# Altium schematic sheet main_7.SchDoc: main
size 282 x 200 mm; Date: 9/25/2019 7:26:20 PM; SheetNumber: 8; CNAME: RJ Cunningham; GateName_1: G$1; SymbolName_1: A4L-LOC; LibraryName: frames; DeviceSetName: A4L-LOC
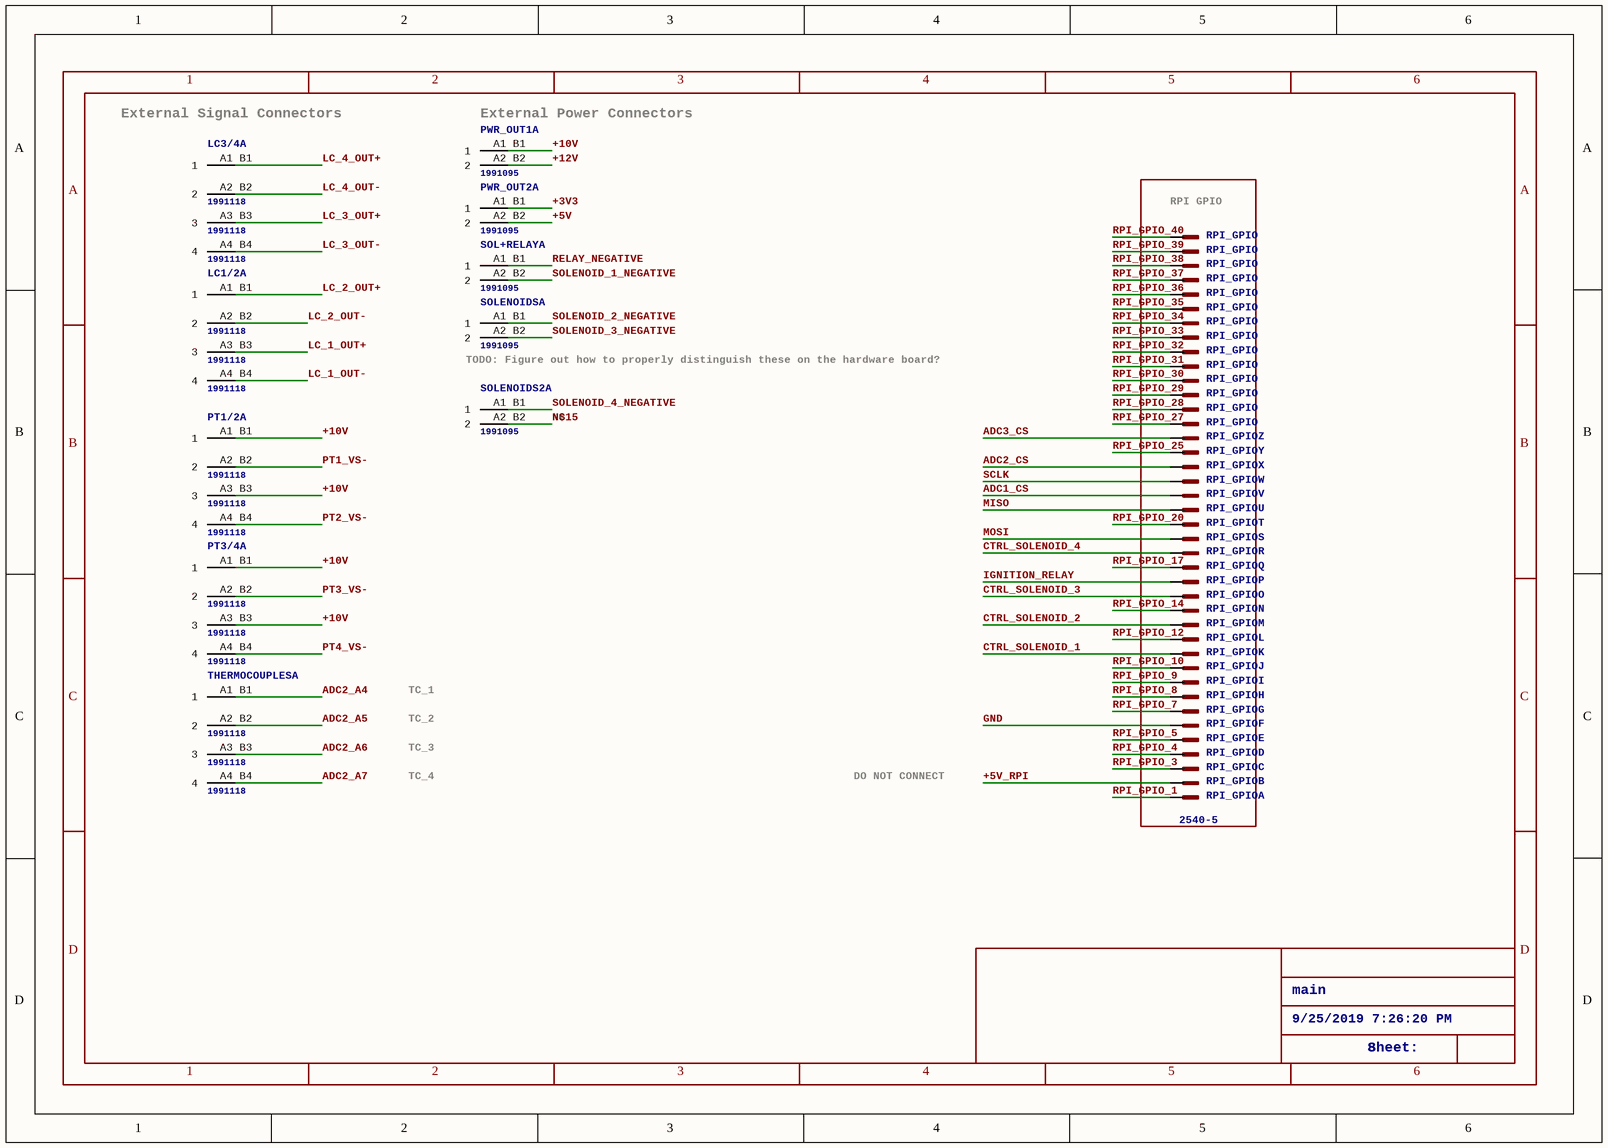
[diagram p0: main_7.SchDoc]

## Parts
LC1/2  1991118  [1991118]  (value not drawn)  (parts A,B,C,D of 4)
LC3/4  1991118  [1991118]  (value not drawn)  (parts A,B,C,D of 4)
PT1/2  1991118  [1991118]  (value not drawn)  (parts A,B,C,D of 4)
PT3/4  1991118  [1991118]  (value not drawn)  (parts A,B,C,D of 4)
PWR_OUT1  1991095  [1991095]  (value not drawn)  (parts A,B of 2)
PWR_OUT2  1991095  [1991095]  (value not drawn)  (parts A,B of 2)
RPI_GPIO  2540-5  [PAK100/2500-5-40]  (parts A,B,C,D,E,F,G,H,I,J,K,L,M,N,O,P,Q,R,S,T,U,V,W,X,Y,Z,27,28,29,30,31,32,33,34,35,36,37,38,39,40 of 40)
SOL+RELAY  1991095  [1991095]  (value not drawn)  (parts A,B of 2)
SOLENOIDS  1991095  [1991095]  (value not drawn)  (parts A,B of 2)
SOLENOIDS2  1991095  [1991095]  (value not drawn)  (parts A,B of 2)
THERMOCOUPLES  1991118  [1991118]  (value not drawn)  (parts A,B,C,D of 4)

## Blocks framed on the sheet
RPI GPIO: RPI_GPIO

## Nets
+3V3: PWR_OUT2.A1_B1(1)
+5V: PWR_OUT2.A2_B2(2)
+5V_RPI: RPI_GPIO.2(KL)
+10V: PT1/2.A1_B1(1) PT1/2.A3_B3(3) PT3/4.A1_B1(1) PT3/4.A3_B3(3) PWR_OUT1.A1_B1(1)
+12V: PWR_OUT1.A2_B2(2)
ADC1_CS: RPI_GPIO.22(KL)
ADC2_A4: THERMOCOUPLES.A1_B1(1)
ADC2_A5: THERMOCOUPLES.A2_B2(2)
ADC2_A6: THERMOCOUPLES.A3_B3(3)
ADC2_A7: THERMOCOUPLES.A4_B4(4)
ADC2_CS: RPI_GPIO.24(KL)
ADC3_CS: RPI_GPIO.26(KL)
CTRL_SOLENOID_1: RPI_GPIO.11(KL)
CTRL_SOLENOID_2: RPI_GPIO.13(KL)
CTRL_SOLENOID_3: RPI_GPIO.15(KL)
CTRL_SOLENOID_4: RPI_GPIO.18(KL)
GND: RPI_GPIO.6(KL)
IGNITION_RELAY: RPI_GPIO.16(KL)
LC_1_OUT+: LC1/2.A3_B3(3)
LC_1_OUT-: LC1/2.A4_B4(4)
LC_2_OUT+: LC1/2.A1_B1(1)
LC_2_OUT-: LC1/2.A2_B2(2)
LC_3_OUT+: LC3/4.A3_B3(3)
LC_3_OUT-: LC3/4.A4_B4(4)
LC_4_OUT+: LC3/4.A1_B1(1)
LC_4_OUT-: LC3/4.A2_B2(2)
MISO: RPI_GPIO.21(KL)
MOSI: RPI_GPIO.19(KL)
N$15: SOLENOIDS2.A2_B2(2)
PT1_VS-: PT1/2.A2_B2(2)
PT2_VS-: PT1/2.A4_B4(4)
PT3_VS-: PT3/4.A2_B2(2)
PT4_VS-: PT3/4.A4_B4(4)
RELAY_NEGATIVE: SOL+RELAY.A1_B1(1)
RPI_GPIO_1: RPI_GPIO.1(KL)
RPI_GPIO_3: RPI_GPIO.3(KL)
RPI_GPIO_4: RPI_GPIO.4(KL)
RPI_GPIO_5: RPI_GPIO.5(KL)
RPI_GPIO_7: RPI_GPIO.7(KL)
RPI_GPIO_8: RPI_GPIO.8(KL)
RPI_GPIO_9: RPI_GPIO.9(KL)
RPI_GPIO_10: RPI_GPIO.10(KL)
RPI_GPIO_12: RPI_GPIO.12(KL)
RPI_GPIO_14: RPI_GPIO.14(KL)
RPI_GPIO_17: RPI_GPIO.17(KL)
RPI_GPIO_20: RPI_GPIO.20(KL)
RPI_GPIO_25: RPI_GPIO.25(KL)
RPI_GPIO_27: RPI_GPIO.27(KL)
RPI_GPIO_28: RPI_GPIO.28(KL)
RPI_GPIO_29: RPI_GPIO.29(KL)
RPI_GPIO_30: RPI_GPIO.30(KL)
RPI_GPIO_31: RPI_GPIO.31(KL)
RPI_GPIO_32: RPI_GPIO.32(KL)
RPI_GPIO_33: RPI_GPIO.33(KL)
RPI_GPIO_34: RPI_GPIO.34(KL)
RPI_GPIO_35: RPI_GPIO.35(KL)
RPI_GPIO_36: RPI_GPIO.36(KL)
RPI_GPIO_37: RPI_GPIO.37(KL)
RPI_GPIO_38: RPI_GPIO.38(KL)
RPI_GPIO_39: RPI_GPIO.39(KL)
RPI_GPIO_40: RPI_GPIO.40(KL)
SCLK: RPI_GPIO.23(KL)
SOLENOID_1_NEGATIVE: SOL+RELAY.A2_B2(2)
SOLENOID_2_NEGATIVE: SOLENOIDS.A1_B1(1)
SOLENOID_3_NEGATIVE: SOLENOIDS.A2_B2(2)
SOLENOID_4_NEGATIVE: SOLENOIDS2.A1_B1(1)

## Notes on the sheet
- (near LC3/4) External Signal Connectors
- (near PWR_OUT1) External Power Connectors
- (near SOLENOIDS) TODO: Figure out how to properly distinguish these on the hardware board?
- NC
- TC_1
- TC_2
- TC_3
- TC_4
- DO NOT CONNECT
- main
- 9/25/2019 7:26:20 PM
- 8
- Sheet:
- 1
- 2
- 3
- 4
- 5
- 6
- A
- B
- C
- D

## Library data of the parts
LC1/2 LC3/4 PT1/2 PT3/4 THERMOCOUPLES = 1991118: GateName_1: CON; SymbolName_1: STP1; GateName_2: G$2; SymbolName_2: STP2; GateName_3: G$3; SymbolName_3: STP3; GateName_4: G$4; SymbolName_4: STP4; LibraryName: con-phoenix-500-extra; DeviceSetName: 1991118
PWR_OUT1 PWR_OUT2 SOL+RELAY SOLENOIDS SOLENOIDS2 = 1991095: GateName_1: CON; SymbolName_1: STP1; GateName_2: G$2; SymbolName_2: STP2; LibraryName: con-phoenix-500-extra; DeviceSetName: 1991095
RPI_GPIO = 2540-5: 3M (TM) Pak 100 4-Wall HeaderSource: 3M; GateName_1: -1; SymbolName_1: PINV; GateName_2: -2; SymbolName_2: PIN; GateName_3: -3; GateName_4: -4; GateName_5: -5; GateName_6: -6; GateName_7: -7; GateName_8: -8; GateName_9: -9; GateName_10: -10; GateName_11: -11; GateName_12: -12; GateName_13: -13; GateName_14: -14; GateName_15: -15; GateName_16: -16; GateName_17: -17; GateName_18: -18; GateName_19: -19; GateName_20: -20; GateName_21: -21; GateName_22: -22; GateName_23: -23; GateName_24: -24; GateName_25: -25; GateName_26: -26; GateName_27: -27; GateName_28: -28; GateName_29: -29; GateName_30: -30; GateName_31: -31; GateName_32: -32; GateName_33: -33; GateName_34: -34; GateName_35: -35; GateName_36: -36; GateName_37: -37; GateName_38: -38; GateName_39: -39; GateName_40: -40; DeviceName: 5; DeviceSetName: 2540-; SymbolName_3: PIN; SymbolName_4: PIN; SymbolName_5: PIN; SymbolName_6: PIN; SymbolName_7: PIN; SymbolName_8: PIN; SymbolName_9: PIN; SymbolName_10: PIN; SymbolName_11: PIN; SymbolName_12: PIN; SymbolName_13: PIN; SymbolName_14: PIN; SymbolName_15: PIN; SymbolName_16: PIN; SymbolName_17: PIN; SymbolName_18: PIN; SymbolName_19: PIN; SymbolName_20: PIN; SymbolName_21: PIN; SymbolName_22: PIN; SymbolName_23: PIN; SymbolName_24: PIN; SymbolName_25: PIN; SymbolName_26: PIN; SymbolName_27: PIN; SymbolName_28: PIN; SymbolName_29: PIN; SymbolName_30: PIN; SymbolName_31: PIN; SymbolName_32: PIN; SymbolName_33: PIN; SymbolName_34: PIN; SymbolName_35: PIN; SymbolName_36: PIN; SymbolName_37: PIN; SymbolName_38: PIN; SymbolName_39: PIN; SymbolName_40: PIN; LibraryName: con-3m; MF: *; MPN: *; OC_FARNELL: 9838414; OC_NEWARK: unknown